# Altium schematic sheet ELEC5550_Team_26_Driver_&_Receiver_Schematic.SchDoc
size A4; SheetNumber: 1; SheetTotal: 3
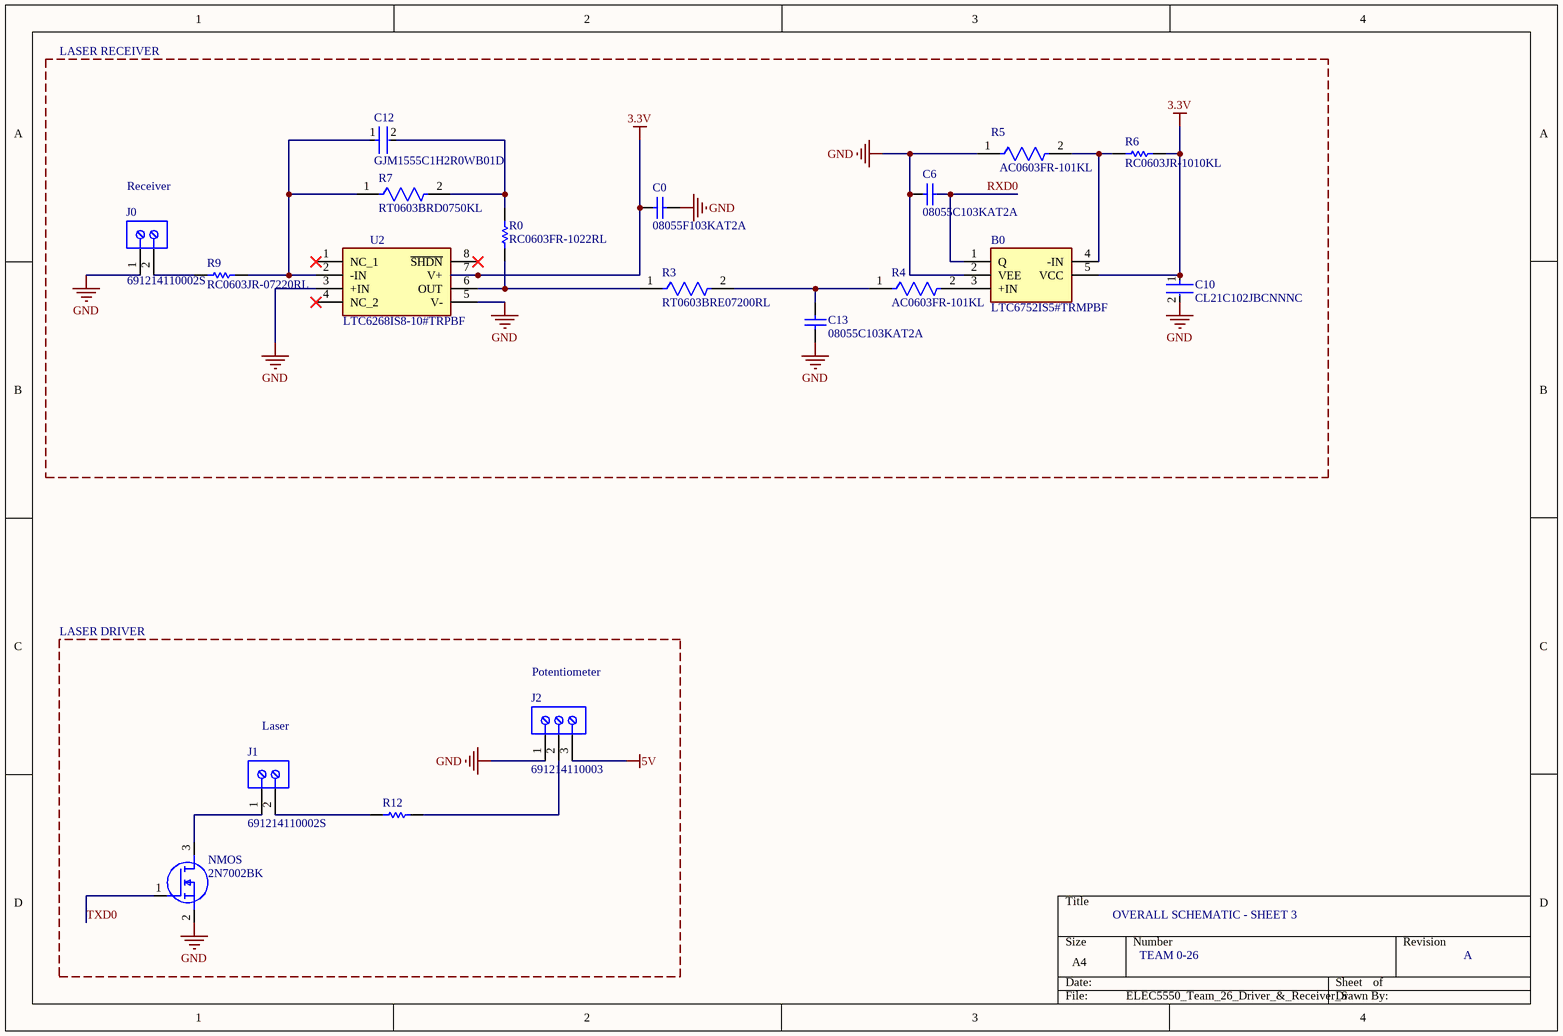
[diagram p0: ELEC5550_Team_26_Driver_&_Receiver_Schematic.SchDoc]

## Parts
B0  LTC6752IS5#TRMPBF  [SOT95P280X100-5N]
C0  08055F103KAT2A  [CAPC2013X140X50LL20T25]
C6  08055C103KAT2A  [CAPC2013X140X50LL20T25]
C10  CL21C102JBCNNNC  [FP-C0805C-DN-MFG]
C12  GJM1555C1H2R0WB01D  [FP-GJM155-0_05-IPC_A]
C13  08055C103KAT2A  [CAPC2013X140X50LL20T25]
J0  691214110002S  [691214110002S]
J1  691214110002S  [691214110002S]
J2  691214110003  [691214110003]
NMOS  2N7002BK  [TL431CDBZR215]
R0  RC0603FR-1022RL  [RESC1608X55X25LL10T15]
R3  RT0603BRE07200RL  [FP-RT0603-MFG]
R4  AC0603FR-101KL  [FP-AC0603-IPC_C]
R5  AC0603FR-101KL  [FP-AC0603-IPC_C]
R6  RC0603JR-1010KL  [RESC1608X55X25LL10T15]
R7  RT0603BRD0750KL  [FP-RT0603-0_55-MFG]
R9  RC0603JR-07220RL  [RESC1608X55X25LL10T15]
R12  RC0603FR-07560RL  [RESC1608X55X25ML10T15]  (value not drawn)
U2  LTC6268IS8-10#TRPBF  [SOIC127P599X175-8N]

## Nets
3.3V: B0.5(VCC) C0.1 C10.1 R6.2 U2.7(V+)
5V: J2.3
GND: B0.2(VEE) C0.2 C6.2 C10.2 C13.1 J0.1 J2.1 NMOS.2(S) R5.1 U2.3(+IN) U2.5(V-)
RXD0: B0.1(Q) C6.1
TXD0: NMOS.1(G)
NetB0_3: B0.3(+IN) R4.2
NetB0_4: B0.4(-IN) R5.2 R6.1
NetC12_1: C12.1 R7.1 R9.2 U2.2(-IN)
NetC12_2: C12.2 R0.2 R7.2
NetC13_2: C13.2 R3.2 R4.1
NetJ0_2: J0.2 R9.1
NetJ1_1: J1.1 NMOS.3(D)
NetJ1_2: J1.2 R12.1
NetJ2_2: J2.2 R12.2
NetR0_1: R0.1 R3.1 U2.6(OUT)

Not connected (* = marked no-connect by the designer): U2 1(NC_1)* 4(NC_2)* 8(~{SHDN})*

## Notes on the sheet
- LASER RECEIVER
- Receiver
- LASER DRIVER
- Potentiometer
- Laser
- OVERALL SCHEMATIC - SHEET 3
- TEAM 0-26
- A

## Library data of the parts
B0 = LTC6752IS5#TRMPBF: LINEAR TECHNOLOGY - LTC6752IS5#TRMPBF - Analogue Comparator, Single, High Speed, 1 Comparator, 3.4 ns, 2.45V to 3.5V, TSOT-23, 5 Pins; Manufacturer_Name: Analog Devices; Geometry.Height: 1mm; Mouser Part Number: 584-LTC6752IS5TRMPBF; Mouser Price/Stock: https://www.mouser.co.uk/ProductDetail/Analog-Devices/LTC6752IS5TRMPBF?qs=hVkxg5c3xu9c5xiGZDI2qQ%3D%3D; Manufacturer_Part_Number: LTC6752IS5#TRMPBF; Datasheet Link: https://datasheet.datasheetarchive.com/originals/distributors/DKDS-14/269585.pdf
C0 = CMP-2007-04788-1: Manufacturer: AVX Interconnect / Elco; Part Number: 08055F103KAT2A
C6 C13 = CMP-2007-04788-1: Part Number: 08055F103KAT2A; Manufacturer: AVX Interconnect / Elco
C10 = CMP-03020-033764-1: C0805 1,000 pF X7R 30ppm/°C 5.00% 50 V; Manufacturer: KEMET; Manufacturer Part Number: C0805C102J5RAC; Material: Ceramic; Voltage Rating: 50 V; Tolerance: 0.05; Mouser Description: Multilayer Ceramic Capacitors MLCC - SMD/SMT 50volts 1000pF 5% X7R; Ipc Land Pattern Name: CAPC200125X78; ComponentLink2Description: Datasheet; Package: C0805C-DN; Height: 0.88mm; Device Class L2: Capacitors; Temperature Range High: +125°C; Device Class L1: Passive Components; RoHS: TRUE; Temperature Coefficient: 30ppm/°C; Octopart: https://octopart.com/c0805c102j5rac-kemet-1343162; Capacitance: 1,000 pF; Temperature Range Low: -55°C; Lead Free: Yes; Temperature Characteristic: X7R; Value: 1,000 pF; Automotive: No; ComponentLink2URL: https://content.kemet.com/datasheets/KEM_C1003_C0G_SMD.pdf; Device Class L3: Ceramic Capacitors; Category: Cap; Temperature: -55°C to +125°C
C12 = CMP-2008-03832-2: Multi-Layer Ceramic Capacitor 2pF C0G  ±0.05pF 0402 Paper T/R; Voltage Rating (DC): 50V; Case Code (Imperial): 0402; Min Operating Temperature: -55°C; Termination: SMD/SMT; Mount: Surface Mount; Height: 0.5mm; Capacitance: 2pF; Case Code (Metric): 1005; Depth: 0.5mm; Dielectric: C0G; Case/Package: 0402; Package Quantity: 10000; Width: 0.02inch; Length: 1mm; Thickness: 0.022inch; Packaging: Tape and Reel; Voltage Rating: 50V; Radiation Hardening: No; Max Operating Temperature: 125°C; Lead Free: Lead Free
J0 J1 = CMP-1502-02465-2: NexarPartId: 94172715; Voltage Rating: 300V; Number of Contacts: 2; Current Rating: 10A; Lead Pitch: 3.5mm; Height: 9.2mm; Min Operating Temperature: -30°C; Number of Pins: 2; Packaging: Box; Max Operating Temperature: 120°C; Contact Material: Nickel, Tin; Number of Rows: 1
J2 = CMP-1502-02466-2: NexarPartId: 18818289; Number of Levels: 1; Voltage: 300V; Pitch: 3.5052mm; Stripping Length: -6mm; Number of Positions Per Level: 3; Plating: Brass, Steel; Wire/Cable Gauge: 24AWG; Wire Gauge (Min): 16AWG; Current Rating: 10A; Width: 10.9mm; Length: 7.4mm; Housing Material: Nylon; Height: 12.2mm; Min Operating Temperature: -40°C; Contact Plating: Brass, Tin; Packaging: Box; Color: Blue, Green; Number of Contacts: 3; Number of Pins: 3; Voltage Rating: 300V; Termination: Screw; Lead Pitch: 3.5mm; Max Operating Temperature: 105°C; Mount: Through Hole; Contact Material: Brass; RoHS: Compliant; Wire Gauge (Max): 24AWG; Current: 10A; REACH SVHC: Unknown
NMOS = 2N7002BK: MOSFET (N-Channel); Manufacturer_Name: Nexperia; Datasheet Link: https://componentsearchengine.com/Datasheets/2/2N7002BK.pdf; Height: 1.1mm; Manufacturer_Part_Number: 2N7002BK; Mouser Part Number: N/A; Mouser Price/Stock: https://www.mouser.co.uk/ProductDetail/Nexperia/2N7002BK?qs=vHuUswq2%252Bsy7zq%252BdG1DqyA%3D%3D
R0 = CMP-2000-04180-1: Manufacturer: Yageo; Part Number: RC0603FR-1022RL
R3 = CMP-03412-013175-1: RES SMD 200 OHM 0.1% 1/10W 0603; Manufacturer: Yageo; Temperature Coefficient: 50 ppm/°C; Value: 200Ω; Voltage Rating: 75V; Tolerance: 0.001; Power Rating: 0.1W; RoHS: TRUE; Temperature Range High: +155°C; Package: RT0603; Ipc Land Pattern Name: RESC16080X45; Device Class L1: Passive Components; Device Class L3: Chip SMD Resistors; Automotive: No; Category: Res; Digikey Description: RES SMD 200 OHM 0.1% 1/10W 0603; Composition: Thin Film; Height: 0.55mm; Manufacturer Part Number: RT0603BRE07200RL; ComponentLink2URL: http://www.yageo.com/documents/recent/PYu-RT_1-to-0.01_RoHS_L_9.pdf; Temperature: -55°C to +155°C; ComponentLink2Description: Datasheet; Octopart: https://octopart.com/rt0603bre07200rl-yageo-1413156; Device Class L2: Resistors; Resistance: 200Ω; Footprint Url: http://www.yageo.com/exep/pages/download/literatures/PYu-R_Mount_10.pdf; Series: RT; Temperature Range Low: -55°C; Lead Free: Yes
R4 R5 = CMP-03412-045511-1: RES 1kΩ 1.00% 0.1W 0603; Power Rating: 100mW; Resistance: 1kR; Tolerance: 1%; Temperature Coefficient: 100ppm/°C; Voltage Rating: 50V; Max Operating Temperature: 155°C; Height: 0.45mm; RoHS Compliant: Yes; Series: AC; Termination: SMD/SMT; Length: 1.6mm; Packaging: Tape and Reel; Case/Package: 0603; Case Code (Imperial): 0603; Min Operating Temperature: -55°C; Case Code (Metric): 1608; Width: 0.8mm
R6 = CMP-2000-04303-1: Manufacturer: Yageo; Part Number: RC0603JR-1010KL
R7 = CMP-03412-048226-1: RES 50K OHM 0.1% 1/10W 0603
R9 = CMP-1012-00058-2: Chip Resistor, 220 Ohm, +/- 5%, 0.1 W, -55 to 155 degC, 0603 (1608 Metric), RoHS, Tape and Reel; Manufacturer: Yageo; Temperature Coefficient: 100PPM/C; Voltage Rating: 50V; Resistance: 220Ohms; Power Rating: 100mW; Mounting Technology: SurfaceMount; Tolerance: 5%; Datasheet URL: http://www.yageo.com/documents/recent/PYu-RC_Group_51_RoHS_L_7.pdf; Operating Temperature Range: -55Cto+155C; Packaging: Reel; Package Description: 2-Pin Surface Mount Device, Body 1.6 x 0.8 mm; Termination Style: SMD/SMT; Datasheet Version: Rev. 7, 05/2017; Product: ThickFilmResistorsGeneralPurpose; Package Reference: 0603; Case Code - in: 0603; Manufacturer URL: http://www.yageo.com/; Case Code - mm: 1608; Series: RC
R12 = CMP-1659-00038-1: Chip Resistor, 560 Ohm, +/- 1%, 0.1 W, -55 to 155 degC, 0603 (1608 Metric), RoHS, Tape and Reel; Resistance: 820 Ohm; Case\Package: 0603; Power Rating: 100 mW; Voltage Rating (DC): 50 V; Height: 0.45 mm; Case Code (Metric): 1608; Max Operating Temperature: 155 degC; PackageDescription: 2-Pin Surface Mount Device, Body 1.6 x 0.8 mm; PackageReference: 0603; ComponentLink2Description: Datasheet; ComponentLink1Description: Manufacturer URL; Case Code (Imperial): 0603; Packaging: Tape and Reel; DatasheetVersion: Rev. 4, 02/2016; ComponentLink2URL: http://www.yageo.com/documents/recent/PYu-RC_Group_51_RoHS_L_04.pdf; Length: 1.6 mm; Mount: Surface Mount; Min Operating Temperature: -55 degC; Pins: 2; RoHSCompliant: true; Voltage Rating: 50 V; REACH SVHC: No SVHC; Tolerance: 1%; ComponentLink1URL: http://www.yageo.com/; Width: 0.8 mm
U2 = LTC6268IS8-10#TRPBF: Integrated Circuit; Manufacturer_Name: Analog Devices; Datasheet Link: https://www.analog.com/media/en/technical-documentation/data-sheets/626810f.pdf; Height: 1.752mm; Manufacturer_Part_Number: LTC6268IS8-10#TRPBF; Mouser Part Number: 584-C6268IS8-10TRPBF; Mouser Price/Stock: https://www.mouser.co.uk/ProductDetail/Analog-Devices/LTC6268IS8-10TRPBF?qs=oahfZPh6IALedkwOOQIbIw%3D%3D; Arrow Part Number: LTC6268IS8-10#TRPBF; Arrow Price/Stock: https://www.arrow.com/en/products/ltc6268is8-10trpbf/analog-devices?utm_currency=USD&region=nac